# Altium schematic sheet MainBoard.SchDoc
size A3
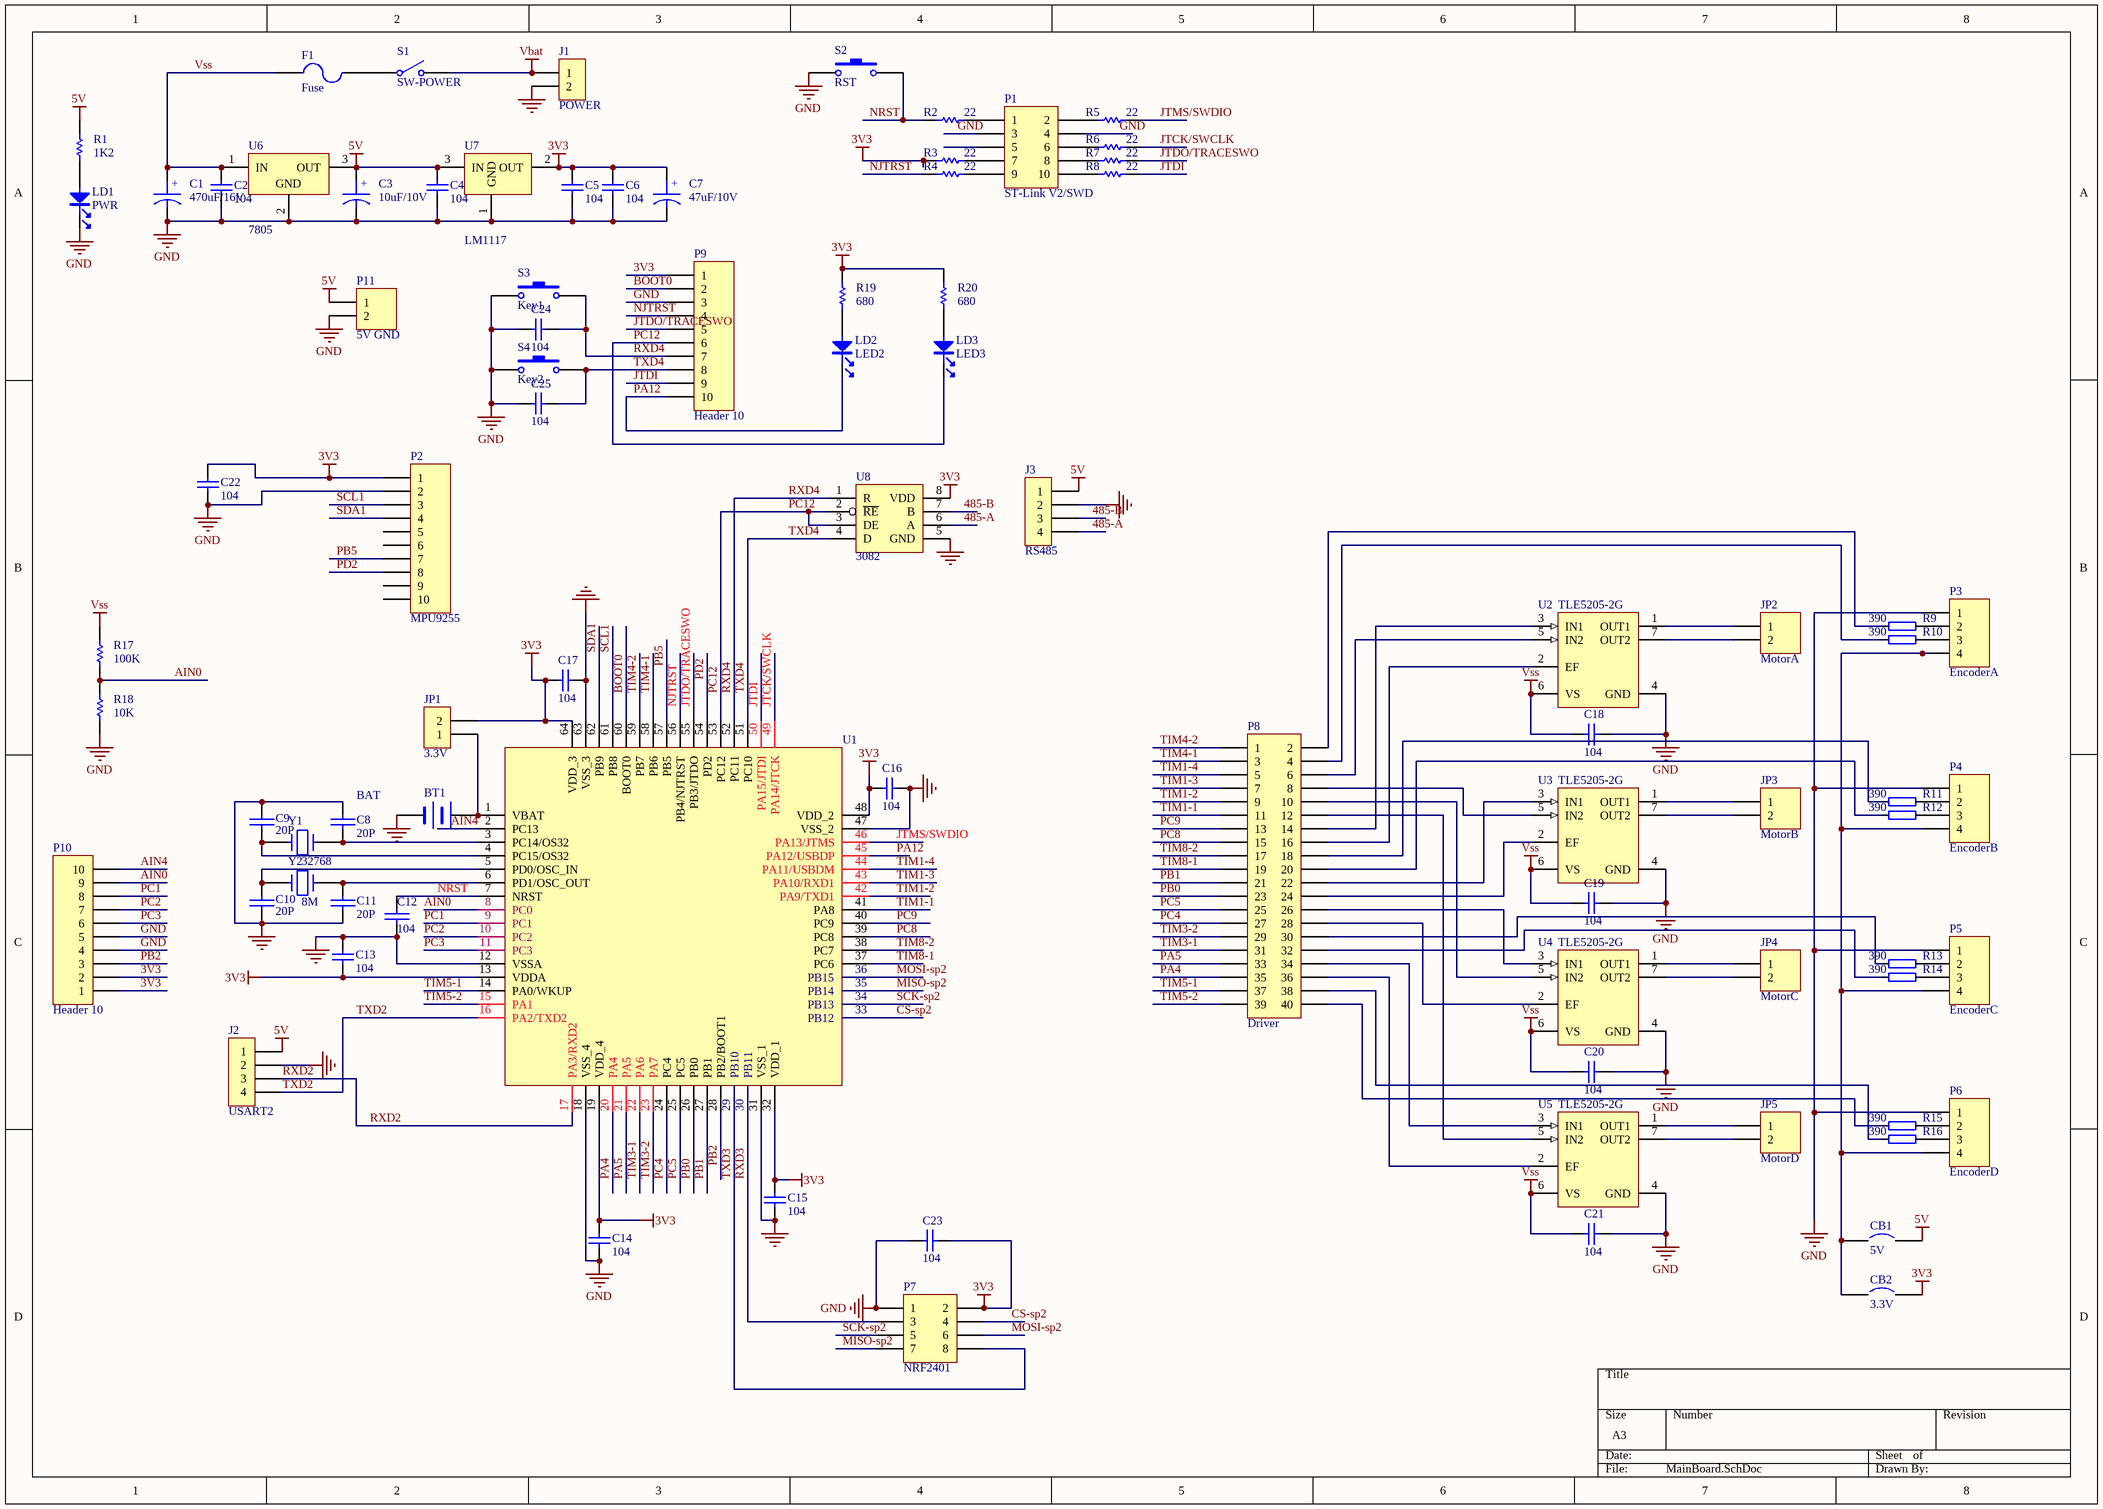
[diagram p0: MainBoard.SchDoc]

## Parts
BT1  BAT  [SIP2 - duplicate]
C1  470uF/16V  [RB2]
C2  value 104  [0603]  (hidden comment: Cap)
C3  10uF/10V  [RB2]
C4  value 104  [0603]  (hidden comment: Cap)
C5  value 104  [0603]  (hidden comment: Cap)
C6  value 104  [0603]  (hidden comment: Cap)
C7  47uF/10V  [RB2]
C8  20P  [0603]
C9  20P  [0603]
C10  20P  [0603]
C11  20P  [0603]
C12  value 104  [0603]
C13  value 104  [0603]  (hidden comment: Cap)
C14  value 104  [0603]  (hidden comment: Cap)
C15  value 104  [0603]  (hidden comment: Cap)
C16  value 104  [0603]  (hidden comment: Cap)
C17  value 104  [0603]  (hidden comment: Cap)
C18  value 104  [0603]  (hidden comment: Cap)
C19  value 104  [0603]  (hidden comment: Cap)
C20  value 104  [0603]  (hidden comment: Cap)
C21  value 104  [0603]  (hidden comment: Cap)
C22  value 104  [0603]  (hidden comment: Cap)
C23  value 104  [0603]  (hidden comment: Cap)
C24  value 104  [0603]  (hidden comment: Cap)
C25  value 104  [0603]  (hidden comment: Cap)
CB1  5V  [SIP2 - duplicate]
CB2  3.3V  [SIP2 - duplicate]
F1  Fuse  [1808Shell]
J1  POWER  [SIP2-150]
J2  USART2  [sip4]
J3  RS485  [sip4]
JP1  3.3V  [SIP2 - duplicate]
JP2  MotorA  [SIP2-150]
JP3  MotorB  [SIP2-150]
JP4  MotorC  [SIP2-150]
JP5  MotorD  [SIP2-150]
LD1  PWR  [0603]
LD2  LED2  [0603]
LD3  LED3  [0603]
P1  ST-Link V2/SWD  [HDR2X5]
P2  MPU9255  [HDR1X10]
P3  EncoderA  [HDR1X4]
P4  EncoderB  [HDR1X4]
P5  EncoderC  [HDR1X4]
P6  EncoderD  [HDR1X4]
P7  NRF2401  [HDR2X4]
P8  Driver  [HDR2X20]
P9  Header 10  [HDR1X10]
P10  Header 10  [HDR1X10]
P11  5V GND  [HDR1X2]
R1  1K2  [0603]
R2  22  [0603]
R3  22  [0603]
R4  22  [0603]
R5  22  [0603]
R6  22  [0603]
R7  22  [0603]
R8  22  [0603]
R9  390  [0603]
R10  390  [0603]
R11  390  [0603]
R12  390  [0603]
R13  390  [0603]
R14  390  [0603]
R15  390  [0603]
R16  390  [0603]
R17  100K  [0603]
R18  10K  [0603]
R19  680  [0603]
R20  680  [0603]
S1  SW-POWER  [SPST-2]
S2  RST  [key2]
S3  Key1  [key2]
S4  Key2  [key2]
U1  (no value)  [quad64]
U2  TLE5205-2G  [INF-PG-TO263-7-1_L]
U3  TLE5205-2G  [INF-PG-TO263-7-1_L]
U4  TLE5205-2G  [INF-PG-TO263-7-1_L]
U5  TLE5205-2G  [INF-PG-TO263-7-1_L]
U6  7805  [ktt]
U7  LM1117  [SPP3]
U8  3082  [so-8]
Y1  32768  [sip2]
Y2  8M  [XTAL1]

## Nets
3V3: C5.2 C6.2 C7.1 C13.1 C14.2 C15.2 C16.1 C17.2 C22.1 C23.1 CB2.2 JP1.2 P2.1 P7.2 P9.1 P10.1 P10.2 R3.1 R19.2 R20.2 U1.13(VDDA) U1.19(VDD_4) U1.32(VDD_1) U1.48(VDD_2) U1.64(VDD_3) U7.2(OUT) U8.8(VDD)
5V: C3.1 C4.2 CB1.2 J2.1 J3.1 P11.1 R1.2 U6.3(OUT) U7.3(IN)
GND: BT1.2(-) C1.2 C2.1 C3.2 C4.1 C5.1 C6.1 C7.2 C8.1 C9.1 C10.2 C11.2 C12.2 C13.2 C14.1 C15.1 C16.2 C17.1 C18.1 C19.1 C20.1 C21.1 C22.2 C23.2 C24.1 C25.1 J1.2 J2.2 J3.2 LD1.2 P1.3 P1.4 P2.2 P3.1 P4.1 P5.1 P6.1 P7.1 P9.3 P10.4 P10.5 P11.2 R18.1 S2.1 S3.1 S4.1 U1.12(VSSA) U1.18(VSS_4) U1.31(VSS_1) U1.47(VSS_2) U1.63(VSS_3) U2.4(GND) U3.4(GND) U4.4(GND) U5.4(GND) U6.2(GND) U7.1(GND) U8.5(GND)
Vbat: J1.1 S1.2(NO)
Vss: C1.1 C2.2 C18.2 C19.2 C20.2 C21.2 F1.1 R17.2 U2.6(VS) U3.6(VS) U4.6(VS) U5.6(VS) U6.1(IN)
485-A: J3.4 U8.6(A)
485-B: J3.3 U8.7(B)
AIN0: P10.9 R17.1 R18.2 U1.8(PC0)
AIN4: P10.10 U1.2(PC13)
BOOT0: P9.2 U1.60(BOOT0)
CS-sp2: P7.4 U1.33(PB12)
JTCK/SWCLK: R6.2 U1.49(PA14/JTCK)
JTDI: P9.9 R8.2 U1.50(PA15/JTDI)
JTDO/TRACESWO: P9.5 R7.2 U1.55(PB3/JTDO)
JTMS/SWDIO: R5.2 U1.46(PA13/JTMS)
MISO-sp2: P7.7 U1.35(PB14)
MOSI-sp2: P7.6 U1.36(PB15)
NJTRST: P9.4 R4.1 U1.56(PB4/NJTRST)
NRST: C12.1 R2.1 S2.2 U1.7(NRST)
PA4: P8.35 U1.20(PA4)
PA5: P8.33 U1.21(PA5)
PA12: LD2.2 P9.10 U1.45(PA12/USBDP)
PB0: P8.23 U1.26(PB0)
PB1: P8.21 U1.27(PB1)
PB2: P10.3 U1.28(PB2/BOOT1)
PB5: P2.7 U1.57(PB5)
PC1: P10.8 U1.9(PC1)
PC2: P10.7 U1.10(PC2)
PC3: P10.6 U1.11(PC3)
PC4: P8.27 U1.24(PC4)
PC5: P8.25 U1.25(PC5)
PC8: P8.15 U1.39(PC8)
PC9: P8.13 U1.40(PC9)
PC12: LD3.2 P9.6 U1.53(PC12) U8.2(~{RE}) U8.3(DE)
PD2: P2.8 U1.54(PD2)
RXD2: J2.3 U1.17(PA3/RXD2)
RXD3: P7.3 U1.30(PB11)
RXD4: C24.2 P9.7 S3.2 U1.52(PC11) U8.1(R)
SCK-sp2: P7.5 U1.34(PB13)
SCL1: P2.3 U1.61(PB8)
SDA1: P2.4 U1.62(PB9)
TIM1-1: P8.11 U1.41(PA8)
TIM1-2: P8.9 U1.42(PA9/TXD1)
TIM1-3: P8.7 U1.43(PA10/RXD1)
TIM1-4: P8.5 U1.44(PA11/USBDM)
TIM3-1: P8.31 U1.22(PA6)
TIM3-2: P8.29 U1.23(PA7)
TIM4-1: P8.3 U1.58(PB6)
TIM4-2: P8.1 U1.59(PB7)
TIM5-1: P8.37 U1.14(PA0/WKUP)
TIM5-2: P8.39 U1.15(PA1)
TIM8-1: P8.19 U1.37(PC6)
TIM8-2: P8.17 U1.38(PC7)
TXD2: J2.4 U1.16(PA2/TXD2)
TXD3: P7.8 U1.29(PB10)
TXD4: C25.2 P9.8 S4.2 U1.51(PC10) U8.4(D)
NetBT1_1: BT1.1(+) JP1.1 U1.1(VBAT)
NetC8_2: C8.2 U1.3(PC14/OS32) Y1.2
NetC9_2: C9.2 U1.4(PC15/OS32) Y1.1
NetC10_1: C10.1 U1.5(PD0/OSC_IN) Y2.1
NetC11_1: C11.1 U1.6(PD1/OSC_OUT) Y2.2
NetCB1_1: CB1.1 CB2.1 P3.4 P4.4 P5.4 P6.4
NetF1_2: F1.2 S1.1(COMMON)
NetJP2_1: JP2.1 U2.1(OUT1)
NetJP2_2: JP2.2 U2.7(OUT2)
NetJP3_1: JP3.1 U3.1(OUT1)
NetJP3_2: JP3.2 U3.7(OUT2)
NetJP4_1: JP4.1 U4.1(OUT1)
NetJP4_2: JP4.2 U4.7(OUT2)
NetJP5_1: JP5.1 U5.1(OUT1)
NetJP5_2: JP5.2 U5.7(OUT2)
NetLD1_1: LD1.1 R1.1
NetLD2_1: LD2.1 R19.1
NetLD3_1: LD3.1 R20.1
NetP1_1: P1.1 R2.2
NetP1_2: P1.2 R5.1
NetP1_6: P1.6 R6.1
NetP1_7: P1.7 R3.2
NetP1_8: P1.8 R7.1
NetP1_9: P1.9 R4.2
NetP1_10: P1.10 R8.1
NetP3_2: P3.2 R9.1
NetP3_3: P3.3 R10.1
NetP4_2: P4.2 R11.1
NetP4_3: P4.3 R12.1
NetP5_2: P5.2 R13.1
NetP5_3: P5.3 R14.1
NetP6_2: P6.2 R15.1
NetP6_3: P6.3 R16.1
NetP8_2: P8.2 R9.2
NetP8_4: P8.4 R10.2
NetP8_6: P8.6 U2.5(IN2)
NetP8_8: P8.8 U3.5(IN2)
NetP8_10: P8.10 U4.5(IN2)
NetP8_12: P8.12 U5.5(IN2)
NetP8_14: P8.14 U2.3(IN1)
NetP8_16: P8.16 U2.2(EF)
NetP8_18: P8.18 R11.2
NetP8_20: P8.20 R12.2
NetP8_22: P8.22 U3.3(IN1)
NetP8_24: P8.24 U3.2(EF)
NetP8_26: P8.26 U4.3(IN1)
NetP8_28: P8.28 U4.2(EF)
NetP8_30: P8.30 R13.2
NetP8_32: P8.32 R14.2
NetP8_34: P8.34 U5.3(IN1)
NetP8_36: P8.36 U5.2(EF)
NetP8_38: P8.38 R16.2
NetP8_40: P8.40 R15.2

Not connected (* = marked no-connect by the designer): P1 5; P2 5 6 9 10

## Notes on the sheet
- (in symbol CAP POL) +

## Library data of the parts
BT1 = BATTERY
C1 C3 C7 = CAP POL: Text Field1: 20; Text Field2: 20
C2 C4-C6 C13-C25 = Cap: Capacitor; Published: 8-Jun-2000; LatestRevisionDate: 17-Jul-2002; LatestRevisionNote: Re-released for DXP Platform.; PackageReference: RAD-0.3; Publisher: Altium Limited; PackageDescription: Radial Cap, Thru-Hole; 2 Leads; 0.3 in Pin Spacing
C8-C12 = CAP: Capacitor
CB1 CB2 = Circuit Breaker: Published: 24-Mar-1999; LatestRevisionDate: 17-Jul-2002; LatestRevisionNote: Re-released for DXP Platform.; PackageReference: SPST-2; Publisher: Altium Limited; PackageDescription: Switch; 2 Leads
F1 = Fuse 2: Published: 8-Jun-2000; LatestRevisionDate: 17-Jul-2002; LatestRevisionNote: Re-released for DXP Platform.; PackageReference: PIN-W2/E2.8; Publisher: Altium Limited; PackageDescription: Thru-Hole; 2 Leads
J1 JP1 = CON2: Connector
J2 J3 = CON4: Connector
JP2-JP5 P11 = Header 2: Header, 2-Pin; LatestRevisionDate: 17-Jul-2002; LatestRevisionNote: Re-released for DXP Platform.; Publisher: Altium Limited
LD1-LD3 = PHOTO
P1 = Header 5X2: Header, 5-Pin, Dual row; LatestRevisionDate: 17-Jul-2002; LatestRevisionNote: Re-released for DXP Platform.; Publisher: Altium Limited
P2 P9 P10 = Header 10: Header, 10-Pin; LatestRevisionDate: 17-Jul-2002; LatestRevisionNote: Re-released for DXP Platform.; Publisher: Altium Limited
P3-P6 = Header 4: Header, 4-Pin; LatestRevisionDate: 17-Jul-2002; LatestRevisionNote: Re-released for DXP Platform.; Publisher: Altium Limited
P7 = Header 4X2: Header, 4-Pin, Dual row; LatestRevisionDate: 17-Jul-2002; LatestRevisionNote: Re-released for DXP Platform.; Publisher: Altium Limited
P8 = Header 20X2: Header, 20-Pin, Dual row; LatestRevisionDate: 17-Jul-2002; LatestRevisionNote: Re-released for DXP Platform.; Publisher: Altium Limited
R1-R8 R17 R19 R20 = Resistor_ST: Resistor 0402 / 0603 / 0805; Value: 10K
R9-R16 = RES
R18 = Resistor_ST: Resistor 0402 / 0603 / 0805; Value: 10K
S1 = SW-SPST: Single-Pole, Single-Throw Switch; Published: 24-Mar-1999; LatestRevisionDate: 17-Jul-2002; LatestRevisionNote: Re-released for DXP Platform.; PackageReference: SPST-2; Publisher: Altium Limited; PackageDescription: Switch; 2 Leads
S2-S4 = SW-PB: Switch; Published: 24-Mar-1999; LatestRevisionDate: 17-Jul-2002; LatestRevisionNote: Re-released for DXP Platform.; PackageReference: SPST-2; Publisher: Altium Limited; PackageDescription: Switch; 2 Leads
U1 = STM32F103R8
U2-U5 = TLE5205-2G: 5 A H-Bridge for DC-Motor Applications, 6 to 40 V, 220 mOhm RDS(on), PG-TO263-7-1, Reel, Green; Manufacturer: Infineon; Current Limit (min.): 6 A; Green: TRUE; Operating Range: 6 to 40 V; Quiescent Current (max.): 10 mA; RthJC (max): 3 K/W; DatasheetVersion: Rev. 1.1; PackageVersion: May-07; PackageReference: PG-TO263-7-1; PackageDescription: 7-Pin Plastic (Green) Transistor Single Outline Package, 9.25 x 10 mm Body, 1.27 mm Pitch; Supplier 1: Digi-Key; Supplier Part Number 1: TLE5205-2GINTR-ND; Supplier 2: Digi-Key; Supplier Part Number 2: TLE5205-2GINCT-ND; Supplier 3: Digi-Key; Supplier Part Number 3: TLE5205-2GINDKR-ND; Supplier 4: Mouser; Supplier Part Number 4: 726-TLE52052G; Halogen-free: TRUE; Packing: Reel; RDS (on) (typ./switch): 220 mOhm; Mounting Technology: Surface Mount; PartNumber: TLE5205-2G; ComponentLink1Description: Manufacturer URL; ComponentLink1URL: http://www.infineon.com/; ComponentLink2Description: Datasheet; ComponentLink2URL: http://www.infineon.com/dgdl/TLE5205-2_DS_11%5B1%5D.pdf?folderId=db3a30431b3e89eb011bb632994f065b&fileId=db3a30431f848401011fc747c7a0797f&location=en.Products.Automotive_ICs.Powertrain_ICs.Powertrain_H-Bridges_for_Electronic_Throttle_Control.DATASHEET.TLE5205-2_DS_11[1].pdf; ComponentLink3Description: Package Specification; ComponentLink3URL: http://www.infineon.com/dgdl/TLE5205-2_DS_11%5B1%5D.pdf?folderId=db3a30431b3e89eb011bb632994f065b&fileId=db3a30431f848401011fc747c7a0797f&sId=db3a30433d68e984013d7d43135b5b6a
U6 = LM330KC: 3-Terminal Positive Regulator; Note: Pin 2 is electrically connected to tab; Published: 15-Apr-2002; DatasheetVersion: Apr-1988; PackageVersion: Sep-1995; PackageReference: KC03; Publisher: Altium Limited; PackageDescription: TO, Thru-Hole, Vertical, Heatsink Mounted; 3 In-Line Leads; Pitch 2.54 mm; ComponentLink1Description: Manufacturer Link; ComponentLink1URL: http://www.ti.com/
U8 = 75176
Y1 Y2 = CRYSTAL